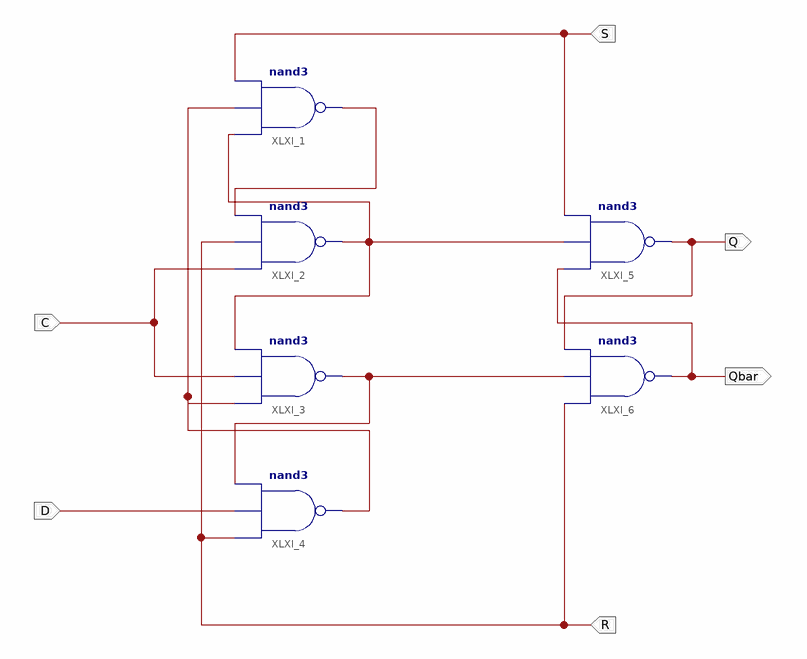
[diagram p0: schematic sheet 1]
// Xilinx ISE schematic D_FLIPFLOP.sch (kintex7) as structural Verilog: 6 symbols, 6 ports
module D_FLIPFLOP (
  input  S,
  input  C,
  input  D,
  input  R,
  output Qbar,
  output Q
);

  wire XLXN_1, XLXN_3, XLXN_4, XLXN_10;

  nand XLXI_1 (XLXN_4, XLXN_3, XLXN_1, S);
  nand XLXI_2 (XLXN_3, C, R, XLXN_4);
  nand XLXI_3 (XLXN_10, XLXN_1, C, XLXN_3);
  nand XLXI_4 (XLXN_1, R, D, XLXN_10);
  nand XLXI_5 (Q, Qbar, XLXN_3, S);
  nand XLXI_6 (Qbar, R, XLXN_10, Q);
endmodule
